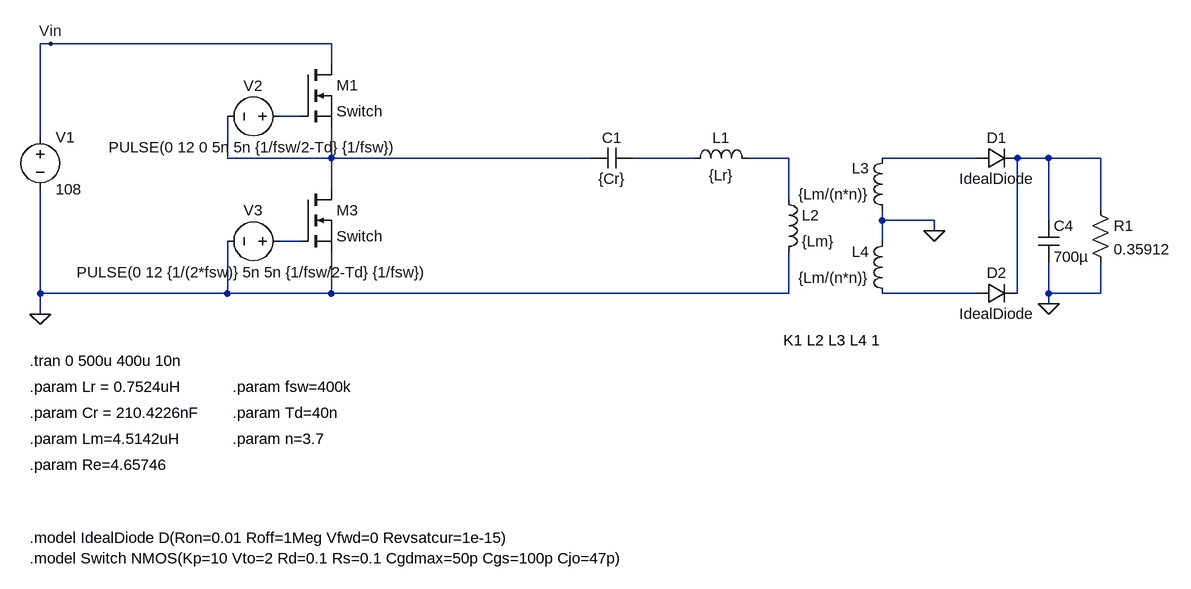
[diagram p0: schematic Full LLC no sync rect.asc]
Full LLC no sync rect.asc, the LTspice schematic file:
Version 4.1
SHEET 1 1740 712
WIRE -576 -96 -592 -96
WIRE -144 -96 -576 -96
WIRE -144 -64 -144 -96
WIRE -192 16 -224 16
WIRE -592 48 -592 -96
WIRE -304 80 -304 16
WIRE -144 80 -144 32
WIRE -144 80 -304 80
WIRE 256 80 -144 80
WIRE 416 80 320 80
WIRE 560 80 496 80
WIRE 848 80 704 80
WIRE 960 80 912 80
WIRE 1040 80 960 80
WIRE -144 128 -144 80
WIRE 560 144 560 80
WIRE 1040 160 1040 80
WIRE 704 176 704 160
WIRE 784 176 704 176
WIRE 960 176 960 80
WIRE 784 192 784 176
WIRE -192 208 -224 208
WIRE 704 208 704 176
WIRE -592 288 -592 128
WIRE -304 288 -304 208
WIRE -304 288 -592 288
WIRE -144 288 -144 224
WIRE -144 288 -304 288
WIRE 560 288 560 224
WIRE 560 288 -144 288
WIRE 848 288 704 288
WIRE 912 288 912 80
WIRE 960 288 960 240
WIRE 1040 288 1040 240
WIRE 1040 288 960 288
WIRE 960 304 960 288
WIRE -592 320 -592 288
FLAG -576 -96 Vin
FLAG -592 320 0
FLAG 784 192 0
FLAG 960 304 0
SYMBOL cap 320 64 R90
WINDOW 0 0 32 VBottom 2
WINDOW 3 32 32 VTop 2
SYMATTR InstName C1
SYMATTR Value {Cr}
SYMBOL ind 400 96 R270
WINDOW 0 32 56 VTop 2
WINDOW 3 5 56 VBottom 2
SYMATTR InstName L1
SYMATTR Value {Lr}
SYMATTR SpiceLine Rser=1m
SYMBOL ind 544 128 R0
SYMATTR InstName L2
SYMATTR Value {Lm}
SYMATTR SpiceLine Rser=1m
SYMATTR Type ind
SYMBOL nmos -192 -64 R0
SYMATTR InstName M1
SYMATTR Value Switch
SYMBOL voltage -592 32 R0
WINDOW 123 0 0 Left 0
WINDOW 39 0 0 Left 0
SYMATTR InstName V1
SYMATTR Value 108
SYMBOL voltage -208 16 R90
WINDOW 0 -32 56 VBottom 2
WINDOW 3 32 56 VTop 2
WINDOW 123 0 0 Left 0
WINDOW 39 0 0 Left 0
SYMATTR InstName V2
SYMATTR Value PULSE(0 12 0 5n 5n {1/fsw/2-Td} {1/fsw})
SYMBOL voltage -208 208 R90
WINDOW 0 -32 56 VBottom 2
WINDOW 3 32 56 VTop 2
WINDOW 123 0 0 Left 0
WINDOW 39 0 0 Left 0
SYMATTR InstName V3
SYMATTR Value PULSE(0 12 {1/(2*fsw)} 5n 5n {1/fsw/2-Td} {1/fsw})
SYMBOL nmos -192 128 R0
SYMATTR InstName M3
SYMATTR Value Switch
SYMBOL ind 720 176 R180
WINDOW 0 36 80 Left 2
WINDOW 3 36 40 Left 2
SYMATTR InstName L3
SYMATTR Value {Lm/(n*n)}
SYMATTR Type ind
SYMATTR SpiceLine Rser=1m
SYMBOL ind 720 304 R180
WINDOW 0 36 80 Left 2
WINDOW 3 36 40 Left 2
SYMATTR InstName L4
SYMATTR Value {Lm/(n*n)}
SYMATTR Type ind
SYMATTR SpiceLine Rser=1m
SYMBOL diode 848 96 R270
WINDOW 0 32 32 VTop 2
WINDOW 3 0 32 VBottom 2
SYMATTR InstName D1
SYMATTR Value IdealDiode
SYMBOL diode 848 304 R270
WINDOW 0 32 32 VTop 2
WINDOW 3 0 32 VBottom 2
SYMATTR InstName D2
SYMATTR Value IdealDiode
SYMBOL res 1024 144 R0
SYMATTR InstName R1
SYMATTR Value 0.35912
SYMBOL cap 944 176 R0
SYMATTR InstName C4
SYMATTR Value 700µ
TEXT -608 432 Left 2 !.param Lr = 0.7524uH
TEXT -608 472 Left 2 !.param Cr = 210.4226nF
TEXT -608 512 Left 2 !.param Lm=4.5142uH
TEXT -608 552 Left 2 !.param Re=4.65746
TEXT -296 432 Left 2 !.param fsw=400k
TEXT -608 392 Left 2 !.tran 0 500u 400u 10n
TEXT -296 472 Left 2 !.param Td=40n
TEXT -608 696 Left 2 !.model Switch NMOS(Kp=10 Vto=2 Rd=0.1 Rs=0.1 Cgdmax=50p Cgs=100p Cjo=47p)
TEXT 552 360 Left 2 !K1 L2 L3 L4 1
TEXT -608 664 Left 2 !.model IdealDiode D(Ron=0.01 Roff=1Meg Vfwd=0 Revsatcur=1e-15)
TEXT -296 512 Left 2 !.param n=3.7

The netlist it stands for:
* Full LLC no sync rect.asc
C1 N003 N002 {Cr}
L1 N003 N004 {Lr} Rser=1m
L2 N004 0 {Lm} Rser=1m
M1 Vin N001 N002 N002 Switch
V1 Vin 0 108
V2 N001 N002 PULSE(0 12 0 5n 5n {1/fsw/2-Td} {1/fsw})
V3 N007 0 PULSE(0 12 {1/(2*fsw)} 5n 5n {1/fsw/2-Td} {1/fsw})
M3 N002 N007 0 0 Switch
L3 0 N005 {Lm/(n*n)} Rser=1m
L4 N008 0 {Lm/(n*n)} Rser=1m
D1 N005 N006 IdealDiode
D2 N008 N006 IdealDiode
R1 N006 0 0.35912
C4 N006 0 700µ
.model D D
.lib standard.dio
.model NMOS NMOS
.model PMOS PMOS
.lib standard.mos
.param Lr = 0.7524uH
.param Cr = 210.4226nF
.param Lm=4.5142uH
.param Re=4.65746
.param fsw=400k
.tran 0 500u 400u 10n
.param Td=40n
.model Switch NMOS(Kp=10 Vto=2 Rd=0.1 Rs=0.1 Cgdmax=50p Cgs=100p Cjo=47p)
K1 L2 L3 L4 1
.model IdealDiode D(Ron=0.01 Roff=1Meg Vfwd=0 Revsatcur=1e-15)
.param n=3.7
.backanno
.end